# EAGLE schematic Mk3 v3.1415926535 (EAGLE 7.5.0)
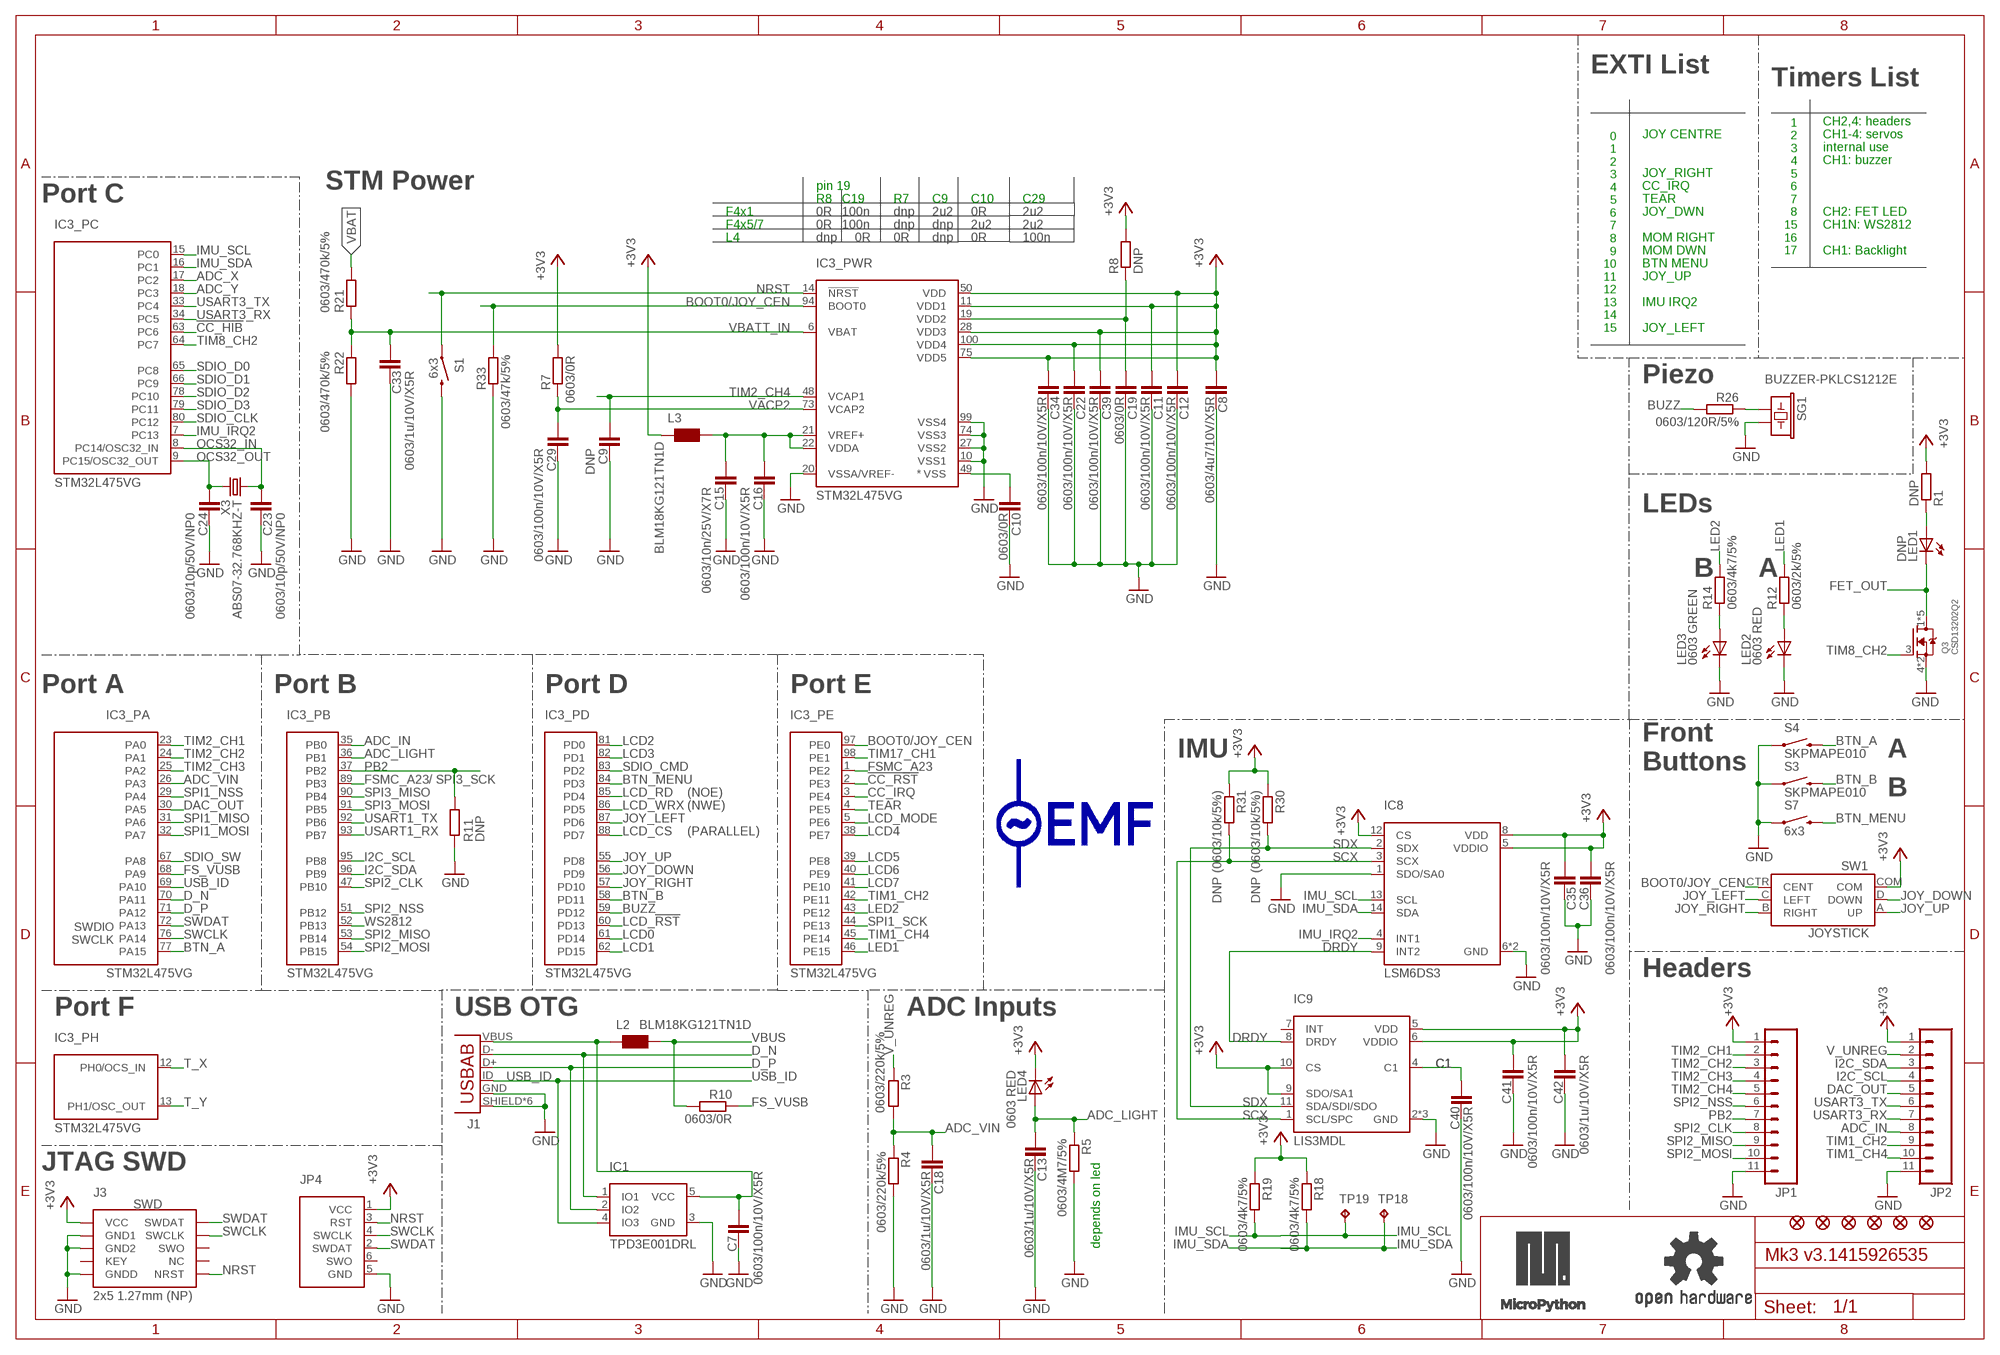
[diagram p0: schematic, sheet 1, part 1 of 2]
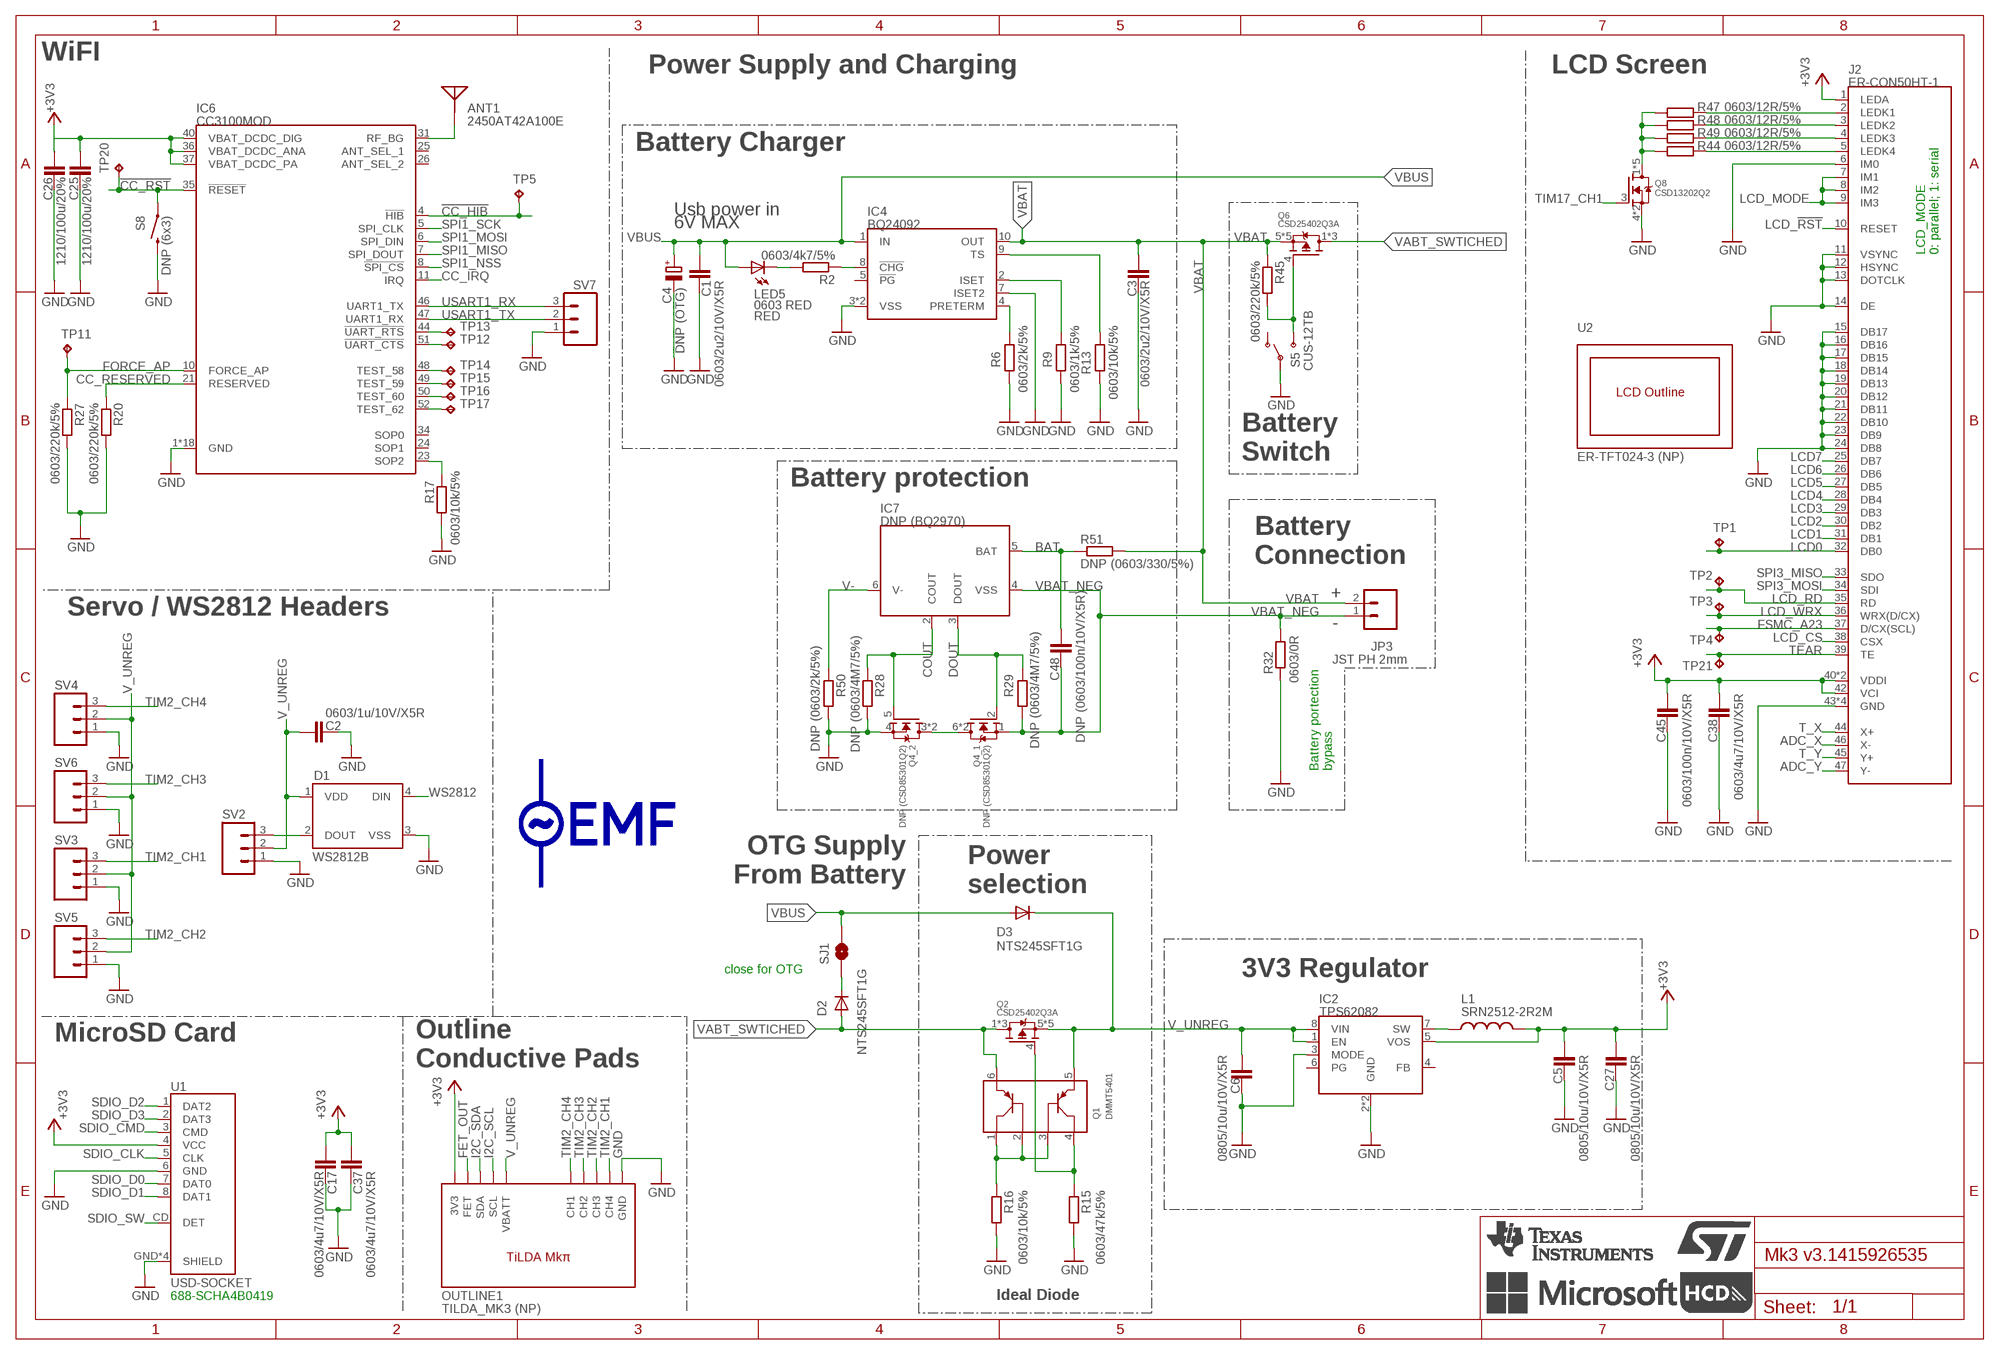
[diagram p1: schematic, sheet 1, part 2 of 2]

## Parts
ANT1  2450AT42A100E  CHIPANT  [2450AT42A100]
C1  0603/2u2/10V/X5R  C-EUC0603K-SMALL  [C0603K-SMALL]
C2  0603/1u/10V/X5R  C-EUC0603K-SMALL  [C0603K-SMALL]
C3  0603/2u2/10V/X5R  C-EUC0603K-SMALL  [C0603K-SMALL]
C4  DNP (OTG)  CPOL-EUE2.5-6  [E2,5-6]
C5  0805/10u/10V/X5R  C-EUC0805-N  [C0805-N]
C6  0805/10u/10V/X5R  C-EUC0805-N  [C0805-N]
C7  0603/100n/10V/X5R  C-EUC0603K-SMALL  [C0603K-SMALL]
C8  0603/4u7/10V/X5R  C-EUC0603K-SMALL  [C0603K-SMALL]
C9  DNP  C-EUC0603K-SMALL  [C0603K-SMALL]
C10  0603/0R  C-EUC0603K-SMALL  [C0603K-SMALL]
C11  0603/100n/10V/X5R  C-EUC0603K-SMALL  [C0603K-SMALL]
C12  0603/100n/10V/X5R  C-EUC0603K-SMALL  [C0603K-SMALL]
C13  0603/1u/10V/X5R  C-EUC0603K-SMALL  [C0603K-SMALL]
C15  0603/10n/25V/X7R  C-EUC0603K-SMALL  [C0603K-SMALL]
C16  0603/100n/10V/X5R  C-EUC0603K-SMALL  [C0603K-SMALL]
C17  0603/4u7/10V/X5R  C-EUC0603K-SMALL  [C0603K-SMALL]
C18  0603/1u/10V/X5R  C-EUC0603K-SMALL  [C0603K-SMALL]
C19  0603/0R  C-EUC0603K-SMALL  [C0603K-SMALL]
C22  0603/100n/10V/X5R  C-EUC0603K-SMALL  [C0603K-SMALL]
C23  0603/10p/50V/NP0  C-EUC0603K-SMALL  [C0603K-SMALL]
C24  0603/10p/50V/NP0  C-EUC0603K-SMALL  [C0603K-SMALL]
C25  1210/100u/20%  C-EUC1210K  [C1210K]
C26  1210/100u/20%  C-EUC1210K  [C1210K]
C27  0805/10u/10V/X5R  C-EUC0805-N  [C0805-N]
C29  0603/100n/10V/X5R  C-EUC0603K-SMALL  [C0603K-SMALL]
C33  0603/1u/10V/X5R  C-EUC0603K-SMALL  [C0603K-SMALL]
C34  0603/100n/10V/X5R  C-EUC0603K-SMALL  [C0603K-SMALL]
C35  0603/100n/10V/X5R  C-EUC0603K-SMALL  [C0603K-SMALL]
C36  0603/100n/10V/X5R  C-EUC0603K-SMALL  [C0603K-SMALL]
C37  0603/4u7/10V/X5R  C-EUC0603K-SMALL  [C0603K-SMALL]
C38  0603/4u7/10V/X5R  C-EUC0603K-SMALL  [C0603K-SMALL]
C39  0603/100n/10V/X5R  C-EUC0603K-SMALL  [C0603K-SMALL]
C40  0603/100n/10V/X5R  C-EUC0603K-SMALL  [C0603K-SMALL]
C41  0603/100n/10V/X5R  C-EUC0603K-SMALL  [C0603K-SMALL]
C42  0603/1u/10V/X5R  C-EUC0603K-SMALL  [C0603K-SMALL]
C45  0603/100n/10V/X5R  C-EUC0603K-SMALL  [C0603K-SMALL]
C48  DNP (0603/100n/10V/X5R)  C-EUC0603K-SMALL  [C0603K-SMALL]
D1  WS2812B  [WS2812B]
D2  NTS245SFT1G  1N4148-SOD123  [SOD123]
D3  NTS245SFT1G  1N4148-SOD123  [SOD123]
FID1  FIDUCIAL1X2.5-STOP  [FIDUCIAL-1X2.5-STOP]
FID2  FIDUCIAL1X2.5-STOP  [FIDUCIAL-1X2.5-STOP]
FID3  FIDUCIAL1X2.5-STOP  [FIDUCIAL-1X2.5-STOP]
FID4  FIDUCIAL1X2.5-STOP  [FIDUCIAL-1X2.5-STOP]
FID5  FIDUCIAL1X2.5-STOP  [FIDUCIAL-1X2.5-STOP]
FID6  FIDUCIAL1X2.5-STOP  [FIDUCIAL-1X2.5-STOP]
IC1  TPD3E001DRL  [DRL-5]
IC2  TPS62082  [WSON8]
IC3  STM32L475VG  STM32F401V  [TQFP100]
IC4  BQ24092  BQ2409X  [HVSSOP10]
IC6  CC3100MOD  CC3100MOD-LWK  [CC3100MOD-LWK]
IC7  DNP (BQ2970)  BQ2970  [WSON-6]
IC8  LSM6DS3  [LGA14]
IC9  LIS3MDL  [LGA12]
J1  ZX62-AB-5PA(11)  USB-AB-LWK  [USB-AB-MICRO-SMD_LWK]
J2  ER-CON50HT-1  ER-TFT024-3  [FH12-50S-0.5SH]
J3  2x5 1.27mm (NP)  SWD_SHROUD-PINHEAD  [PINHEAD_2X05_127]
JP1  (NP)  M11PTH  [1X11]
JP2  (NP)  M11PTH  [1X11]
JP3  JST PH 2mm  M02-JST-2MM-SMT  [JST-2-SMD]
JP4  (NP)  TC2030-SWDNL  [TC2030-MCP-NL]
L1  SRN2512-2R2M  INDUCTOR1008  [1008]
L2  BLM18KG121TN1D  WE-CBF_0805  [WUERTH-0805]
L3  BLM18KG121TN1D  WE-CBF_0805  [WUERTH-0805]
LED1  DNP  LED5MM  [LED5MM]
LED2  0603 RED  LED0603-CORRECT  [LED-0603-CORRECT]
LED3  0603 GREEN  LED0603-CORRECT  [LED-0603-CORRECT]
LED4  0603 RED  LED0603-CORRECT  [LED-0603-CORRECT]
LED5  0603 RED  LED0603-CORRECT  [LED-0603-CORRECT]
LOGO1  OSHW-LOGOM (NP)  OSHW-LOGOM  [OSHW-LOGO-M]
LOGO2  LOGO_TI-4MM (NP)  LOGO_TI-4MM  [LOGO_TI_4MM]
LOGO3  LOGO_ST-4MM (NP)  LOGO_ST-4MM  [LOGO_ST_4MM]
LOGO4  LOGO_HCD-4MM (NP)  LOGO_HCD-4MM  [LOGO_HDC_4MM]
LOGO5  LOGO_MICROSOFT-4MM (NP)  LOGO_MICROSOFT-4MM  [LOGO_MS_4MM]
LOGO6  LOGO_MICROPYTHON-8MM (NP)  LOGO_MICROPYTHON-8MM  [LOGO_MICROPYTHON_8MM]
OUTLINE1  TILDA_MK3 (NP)  TILDA_MK3_BOARDOUTLINE  [TILDA_MKE_OUTLINE]
Q1  DMMT5401  [SOT26]
Q2  CSD25402Q3A  [Q3A]
Q3  CSD13202Q2  [Q2]
Q4  DNP (CSD85301Q2)  CSD85301Q2  [Q2_DUAL]
Q6  CSD25402Q3A  [Q3A]
Q8  CSD13202Q2  [Q2]
R1  DNP  R-EU_0207/10  [0207/10]
R2  0603/4k7/5%  R-EU_0603K-SMALL  [C0603K-SMALL]
R3  0603/220k/5%  R-EU_0603K-SMALL  [C0603K-SMALL]
R4  0603/220k/5%  R-EU_0603K-SMALL  [C0603K-SMALL]
R5  0603/4M7/5%  R-EU_0603K-SMALL  [C0603K-SMALL]
R6  0603/2k/5%  R-EU_0603K-SMALL  [C0603K-SMALL]
R7  0603/0R  R-EU_0603K-SMALL  [C0603K-SMALL]
R8  DNP  R-EU_0603K-SMALL  [C0603K-SMALL]
R9  0603/1k/5%  R-EU_0603K-SMALL  [C0603K-SMALL]
R10  0603/0R  R-EU_0603K-SMALL  [C0603K-SMALL]
R11  DNP  R-EU_0603K-SMALL  [C0603K-SMALL]
R12  0603/2k/5%  R-EU_0603K-SMALL  [C0603K-SMALL]
R13  0603/10k/5%  R-EU_0603K-SMALL  [C0603K-SMALL]
R14  0603/4k7/5%  R-EU_0603K-SMALL  [C0603K-SMALL]
R15  0603/47k/5%  R-EU_0603K-SMALL  [C0603K-SMALL]
R16  0603/10k/5%  R-EU_0603K-SMALL  [C0603K-SMALL]
R17  0603/10k/5%  R-EU_0603K-SMALL  [C0603K-SMALL]
R18  0603/4k7/5%  R-EU_0603K-SMALL  [C0603K-SMALL]
R19  0603/4k7/5%  R-EU_0603K-SMALL  [C0603K-SMALL]
R20  0603/220k/5%  R-EU_0603K-SMALL  [C0603K-SMALL]
R21  0603/470k/5%  R-EU_0603K-SMALL  [C0603K-SMALL]
R22  0603/470k/5%  R-EU_0603K-SMALL  [C0603K-SMALL]
R26  0603/120R/5%  R-EU_0603K-SMALL  [C0603K-SMALL]
R27  0603/220k/5%  R-EU_0603K-SMALL  [C0603K-SMALL]
R28  DNP (0603/4M7/5%)  R-EU_0603K-SMALL  [C0603K-SMALL]
R29  DNP (0603/4M7/5%)  R-EU_0603K-SMALL  [C0603K-SMALL]
R30  DNP (0603/10k/5%)  R-EU_0603K-SMALL  [C0603K-SMALL]
R31  DNP (0603/10k/5%)  R-EU_0603K-SMALL  [C0603K-SMALL]
R32  0603/0R  R-EU_0603K-SMALL  [C0603K-SMALL]
R33  0603/47k/5%  R-EU_0603K-SMALL  [C0603K-SMALL]
R44  0603/12R/5%  R-EU_0603K-SMALL  [C0603K-SMALL]
R45  0603/220k/5%  R-EU_0603K-SMALL  [C0603K-SMALL]
R47  0603/12R/5%  R-EU_0603K-SMALL  [C0603K-SMALL]
R48  0603/12R/5%  R-EU_0603K-SMALL  [C0603K-SMALL]
R49  0603/12R/5%  R-EU_0603K-SMALL  [C0603K-SMALL]
R50  DNP (0603/2k/5%)  R-EU_0603K-SMALL  [C0603K-SMALL]
R51  DNP (0603/330/5%)  R-EU_0603K-SMALL  [C0603K-SMALL]
S1  6x3  SWITCH-MOMENTARY-2-SMD-1101NE  [TACTILE-SWITCH-1101NE]
S3  SKPMAPE010  SWITCH-MOMENTARY-2-SKPMAPE010-COMBINED  [SKPMAPE010-COMBINED]
S4  SKPMAPE010  SWITCH-MOMENTARY-2-SKPMAPE010-COMBINED  [SKPMAPE010-COMBINED]
S5  CUS-12TB  SWITCH-SPST-SMD-A  [SWITCH-SPST-SMD-A]
S7  6x3  SWITCH-MOMENTARY-2-SMD-1101NE  [TACTILE-SWITCH-1101NE]
S8  DNP (6x3)  SWITCH-MOMENTARY-2-SMD-1101NE  [TACTILE-SWITCH-1101NE]
SG1  BUZZER-PKLCS1212E  [BUZZER-PKLCS1212E]
SJ1  OTG (NP)  SOLDERJUMPERNO  [SJ_2S-NO]
SV2  (NP)  M03PTH  [1X03]
SV3  (NP)  M03PTH  [1X03]
SV4  (NP)  M03PTH  [1X03]
SV5  (NP)  M03PTH  [1X03]
SV6  (NP)  M03PTH  [1X03]
SV7  (NP)  M03PTH  [1X03]
SW1  JOYSTICK  JOYSTICK_MINI_MULTICOM_NOSILK  [JOYSTICK_MULTICOMP_NOSILK]
TP1  (NP)  TPB1,27  [B1,27]
TP2  (NP)  TPB1,27  [B1,27]
TP3  (NP)  TPB1,27  [B1,27]
TP4  (NP)  TPB1,27  [B1,27]
TP5  (NP)  TPB1,27  [B1,27]
TP11  (NP)  TPB1,27  [B1,27]
TP12  (NP)  TPB1,27  [B1,27]
TP13  (NP)  TPB1,27  [B1,27]
TP14  (NP)  TPB1,27  [B1,27]
TP15  (NP)  TPB1,27  [B1,27]
TP16  (NP)  TPB1,27  [B1,27]
TP17  (NP)  TPB1,27  [B1,27]
TP18  (NP)  TPB1,27  [B1,27]
TP19  (NP)  TPB1,27  [B1,27]
TP20  (NP)  TPB1,27  [B1,27]
TP21  (NP)  TPB1,27  [B1,27]
U1  USD-SOCKET  USD-SOCKET-SDIO  [0011XAAX09X]
U2  ER-TFT024-3 (NP)  ER-TFT024-3-OUTLINE  [ER-TFT024-3]
X3  ABS07-32.768KHZ-T  RESONATOR_EPSON_FC_145  [RESONATOR_EPSON_FC_145]

## Nets
!CC_HIB: IC3.63(_PC:PC6) IC6.4(!HIB) TP5.TP
!CC_RST: IC3.2(_PE:PE3) IC6.35(!RESET) S8.P$1 TP20.TP
!UART_CTS: IC6.51(!UART_CTS) TP12.TP
!UART_RTS: IC6.44(!UART_RTS) TP13.TP
+3V3: C5.1 C8.2 C11.2 C12.2 C17.2 C22.2 C25.1 C26.1 C27.1 C34.2 C35.1 C36.1 C37.2 C38.2 C39.2 C41.1 C42.1 C45.2 IC2.5(VOS) IC3.11(_PWR:VDD1) IC3.28(_PWR:VDD3) IC3.50(_PWR:VDD) IC3.75(_PWR:VDD5) IC3.100(_PWR:VDD4) IC6.36(VBAT_DCDC_ANA) IC6.37(VBAT_DCDC_PA) IC6.40(VBAT_DCDC_DIG) IC8.5(VDDIO) IC8.8(VDD) IC8.12(CS) IC9.5(VDD) IC9.6(VDDIO) IC9.9(SDO/SA1) IC9.10(CS) J2.1(LEDA) J2.40(VDDI) J2.41(VDDI) J2.42(VCI) J3.1(VCC) JP1.1 JP2.1 JP4.1(VCC) L1.2 L3.1 LED4.C OUTLINE1.3V3 R1.2 R7.1 R8.2 R18.1 R19.1 R30.1 R31.1 SW1.COM U1.4(VCC)
ADC_IN: IC3.35(_PB:PB0) JP2.8
ADC_LIGHT: C13.2 IC3.36(_PB:PB1) LED4.A R5.1
ADC_VIN: C18.2 IC3.26(_PA:PA3) R3.2 R4.1
ADC_X: IC3.17(_PC:PC2) J2.46(X-)
ADC_Y: IC3.18(_PC:PC3) J2.47(Y-)
BAT: C48.2 IC7.5(BAT) R51.1
BOOT0/JOY_CEN: IC3.94(_PWR:BOOT0) IC3.97(_PE:PE0) R33.2 SW1.CTR(CENT)
BTN_A: IC3.77(_PA:PA15) S4.2 S4.B1 S4.B2
BTN_B: IC3.58(_PD:PD11) S3.2 S3.B1 S3.B2
BTN_MENU: IC3.84(_PD:PD3) S7.P$2
BUZZ: IC3.59(_PD:PD12) R26.2
C1: C40.1 IC9.4(C1)
CC_IRQ: IC3.3(_PE:PE4) IC6.11(IRQ)
CC_RESERVED: IC6.21(RESERVED) R20.1
COUT: IC7.2(COUT) Q4.5(_2:G) R28.1
D_N: IC1.1(IO1) IC3.70(_PA:PA11) J1.D-
D_P: IC1.2(IO2) IC3.71(_PA:PA12) J1.D+
DAC_OUT: IC3.30(_PA:PA5) JP2.5
DFGFDG: C15.2 C16.2 IC3.21(_PWR:VREF+) IC3.22(_PWR:VDDA) L3.2
DOUT: IC7.3(DOUT) Q4.2(_1:G) R29.1
DRDY: IC8.9(INT2) IC9.8(DRDY)
FET_OUT: LED1.K(C) OUTLINE1.FET Q3.1(D) Q3.2(D) Q3.5(D) Q3.6(D) Q3.EP1(D)
FORCE_AP: IC6.10(FORCE_AP) R27.1 TP11.TP
FS_VUSB: IC3.68(_PA:PA9) R10.1
FSMC_A23: IC3.1(_PE:PE2) IC3.89(_PB:PB3) J2.37(D/CX(SCL)) TP4.TP
GND: C1.1 C2.1 C3.1 C4.- C5.2 C6.2 C7.1 C8.1 C9.1 C10.1 C11.1 C12.1 C13.1 C15.1 C16.1 C17.1 C18.1 C19.1 C22.1 C23.1 C24.1 C25.2 C26.2 C27.2 C29.1 C33.1 C34.1 C35.2 C36.2 C37.1 C38.1 C39.1 C40.2 C41.2 C42.2 C45.1 D1.3(VSS) IC1.3(GND) IC2.2(GND) IC2.3(MODE) IC2.EP(GND) IC3.10(_PWR:VSS1) IC3.20(_PWR:VSSA/VREF-) IC3.27(_PWR:VSS2) IC3.74(_PWR:VSS3) IC3.99(_PWR:VSS4) IC4.3(VSS) IC4.7(ISET2) IC4.EP(VSS) IC6.1(GND) IC6.2(GND) IC6.16(GND) IC6.27(GND) IC6.28(GND) IC6.30(GND) IC6.32(GND) IC6.38(GND) IC6.43(GND) IC6.55(GND) IC6.56(GND) IC6.57(GND) IC6.58(GND) IC6.59(GND) IC6.60(GND) IC6.61(GND) IC6.62(GND) IC6.63(GND) IC8.1(SDO/SA0) IC8.6(GND) IC8.7(GND) IC9.2(GND) IC9.3(GND) IC9.12(GND) J1.GND J1.SHIELD J1.SHIELD@0(SHIELD) J1.SHIELD@1(SHIELD) J1.SHIELD@2(SHIELD) J1.SHIELD@3(SHIELD) J1.SHIELD@5(SHIELD) J2.6(IM0) J2.11(VSYNC) J2.12(HSYNC) J2.13(DOTCLK) J2.14(DE) J2.15(DB17) J2.16(DB16) J2.17(DB15) J2.18(DB14) J2.19(DB13) J2.20(DB12) J2.21(DB11) J2.22(DB10) J2.23(DB9) J2.24(DB8) J2.43(GND) J2.48(GND) J2.49(GND) J2.50(GND) J3.3(GND1) J3.5(GND2) J3.9(GNDD) JP1.11 JP2.11 JP4.5(GND) LED2.C LED3.C OUTLINE1.GND Q3.4(S) Q3.EP2(S) Q4.4(_2:S) Q8.4(S) Q8.EP2(S) R4.2 R5.2 R6.2 R9.2 R11.1 R13.2 R15.2 R16.2 R17.2 R20.2 R22.2 R27.2 R28.2 R32.1 R33.1 R50.2 S1.P$2 S3.1 S3.A1 S3.A2 S4.1 S4.A1 S4.A2 S5.2(P) S7.P$1 S8.P$2 SG1.P$2 SV2.1 SV3.1 SV4.1 SV5.1 SV6.1 SV7.1 U1.6(GND) U1.GND1(SHIELD) U1.GND2(SHIELD) U1.GND3(SHIELD) U1.GND(SHIELD)
I2C_SCL: IC3.95(_PB:PB8) JP2.4 OUTLINE1.SCL
I2C_SDA: IC3.96(_PB:PB9) JP2.3 OUTLINE1.SDA
IMU_IRQ2: IC3.7(_PC:PC13) IC8.4(INT1)
IMU_SCL: IC3.15(_PC:PC0) IC8.13(SCL) R19.2 TP19.TP
IMU_SDA: IC3.16(_PC:PC1) IC8.14(SDA) R18.2 TP18.TP
JOY_DOWN: IC3.56(_PD:PD9) SW1.D(DOWN)
JOY_LEFT: IC3.87(_PD:PD6) SW1.C(LEFT)
JOY_RIGHT: IC3.57(_PD:PD10) SW1.B(RIGHT)
JOY_UP: IC3.55(_PD:PD8) SW1.A(UP)
LCD0: IC3.61(_PD:PD14) J2.32(DB0) TP1.TP
LCD1: IC3.62(_PD:PD15) J2.31(DB1)
LCD2: IC3.81(_PD:PD0) J2.30(DB2)
LCD3: IC3.82(_PD:PD1) J2.29(DB3)
LCD4: IC3.38(_PE:PE7) J2.28(DB4)
LCD5: IC3.39(_PE:PE8) J2.27(DB5)
LCD6: IC3.40(_PE:PE9) J2.26(DB6)
LCD7: IC3.41(_PE:PE10) J2.25(DB7)
LCD_!RST: IC3.60(_PD:PD13) J2.10(RESET)
LCD_CS: IC3.88(_PD:PD7) J2.38(CSX)
LCD_MODE: IC3.5(_PE:PE6) J2.7(IM1) J2.8(IM2) J2.9(IM3)
LCD_RD: IC3.85(_PD:PD4) J2.35(RD) TP2.TP
LCD_WRX: IC3.86(_PD:PD5) J2.36(WRX(D/CX)) TP3.TP
LED1: IC3.46(_PE:PE15) R12.2
LED2: IC3.43(_PE:PE12) R14.2
LEDK1: J2.2(LEDK1) R47.2
LEDK2: J2.3(LEDK2) R48.2
LEDK3: J2.4(LEDK3) R49.2
LEDK4: J2.5(LEDK4) R44.2
N$3: Q4.3(_2:D) Q4.6(_1:D) Q4.EP1(_1:D) Q4.EP2(_2:D)
N$4: R26.1 SG1.P$1
N$5: C19.2 IC3.19(_PWR:VDD2) R8.1
N$6: Q1.4(C2) Q2.4(G) R15.1
N$7: Q1.1(C1) Q1.2(B1) Q1.3(B2) R16.1
N$8: LED5.C R2.2
N$9: IC4.8(!CHG) R2.1
N$10: IC4.4(PRETERM) R6.1
N$11: IC4.2(ISET) R9.1
N$12: IC4.9(TS) R13.1
N$21: D1.2(DOUT) SV2.3
N$27: C7.2 IC1.5(VCC) J1.VBUS L2.1
N$28: D2.C SJ1.1
N$36: ANT1.P$1 IC6.31(RF_BG)
N$37: C10.2 IC3.49(_PWR:VSS)
N$51: LED3.A R14.1
N$52: LED2.A R12.1
N$60: LED1.A R1.1
N$64: Q8.1(D) Q8.2(D) Q8.5(D) Q8.6(D) Q8.EP1(D) R44.1 R47.1 R48.1 R49.1
NRST: IC3.14(_PWR:!NRST) J3.10(NRST) JP4.3(RST) S1.P$1
OCS32_IN: C23.2 IC3.8(_PC:PC14/OSC32_IN) X3.P$1
OCS32_OUT: C24.2 IC3.9(_PC:PC15/OSC32_OUT) X3.P$2
PB2: IC3.37(_PB:PB2) JP1.7 R11.2
SCX: IC8.3(SCX) IC9.1(SCL/SPC) R31.2
SDIO_CLK: IC3.80(_PC:PC12) U1.5(CLK)
SDIO_CMD: IC3.83(_PD:PD2) U1.3(CMD)
SDIO_D0: IC3.65(_PC:PC8) U1.7(DAT0)
SDIO_D1: IC3.66(_PC:PC9) U1.8(DAT1)
SDIO_D2: IC3.78(_PC:PC10) U1.1(DAT2)
SDIO_D3: IC3.79(_PC:PC11) U1.2(DAT3)
SDIO_SW: IC3.67(_PA:PA8) U1.CD(DET)
SDX: IC8.2(SDX) IC9.11(SDA/SDI/SDO) R30.2
SOP2: IC6.23(SOP2) R17.1
SPI1_MISO: IC3.31(_PA:PA6) IC6.7(SPI_DOUT)
SPI1_MOSI: IC3.32(_PA:PA7) IC6.6(SPI_DIN)
SPI1_NSS: IC3.29(_PA:PA4) IC6.8(!SPI_CS)
SPI1_SCK: IC3.44(_PE:PE13) IC6.5(SPI_CLK)
SPI2_CLK: IC3.47(_PB:PB10) JP1.8
SPI2_MISO: IC3.53(_PB:PB14) JP1.9
SPI2_MOSI: IC3.54(_PB:PB15) JP1.10
SPI2_NSS: IC3.51(_PB:PB12) JP1.6
SPI3_MISO: IC3.90(_PB:PB4) J2.33(SDO)
SPI3_MOSI: IC3.91(_PB:PB5) J2.34(SDI)
SW: IC2.7(SW) L1.1
SWCLK: IC3.76(_PA:PA14) J3.4(SWCLK) JP4.4(SWCLK)
SWDAT: IC3.72(_PA:PA13) J3.2(SWDAT) JP4.2(SWDAT)
T_X: IC3.12(_PH:PH0/OCS_IN) J2.44(X+)
T_Y: IC3.13(_PH:PH1/OSC_OUT) J2.45(Y+)
TEAR: IC3.4(_PE:PE5) J2.39(TE) TP21.TP
TEST_58: IC6.48(TEST_58) TP14.TP
TEST_59: IC6.49(TEST_59) TP15.TP
TEST_60: IC6.50(TEST_60) TP16.TP
TEST_62: IC6.52(TEST_62) TP17.TP
TIM1_CH2: IC3.42(_PE:PE11) JP2.9
TIM1_CH4: IC3.45(_PE:PE14) JP2.10
TIM2_CH1: IC3.23(_PA:PA0) JP1.2 OUTLINE1.CH4 SV3.3
TIM2_CH2: IC3.24(_PA:PA1) JP1.3 OUTLINE1.CH3 SV5.3
TIM2_CH3: IC3.25(_PA:PA2) JP1.4 OUTLINE1.CH2 SV6.3
TIM2_CH4: C9.2 IC3.48(_PWR:VCAP1) JP1.5 OUTLINE1.CH1 SV4.3
TIM8_CH2: IC3.64(_PC:PC7) Q3.3(G)
TIM17_CH1: IC3.98(_PE:PE1) Q8.3(G)
USART1_RX: IC3.93(_PB:PB7) IC6.46(UART1_TX) SV7.3
USART1_TX: IC3.92(_PB:PB6) IC6.47(UART1_RX) SV7.2
USART3_RX: IC3.34(_PC:PC5) JP2.7
USART3_TX: IC3.33(_PC:PC4) JP2.6
USB_ID: IC1.4(IO3) IC3.69(_PA:PA10) J1.ID(USBID)
V-: IC7.6(V-) R50.1
V_UNREG: C2.2 C6.1 D1.1(VDD) D3.C IC2.1(EN) IC2.8(VIN) JP2.2 OUTLINE1.VBATT Q1.5(E2) Q2.5(S) Q2.6(S) Q2.7(S) Q2.8(S) Q2.EP(S) R3.1 SV2.2 SV3.2 SV4.2 SV5.2 SV6.2
VABT_SWTICHED: D2.A Q1.6(E1) Q2.1(D) Q2.2(D) Q2.3(D) Q6.1(D) Q6.2(D) Q6.3(D)
VACP2: C29.2 IC3.73(_PWR:VCAP2) R7.2
VBAT: C3.2 IC4.10(OUT) JP3.2 Q6.5(S) Q6.6(S) Q6.7(S) Q6.8(S) Q6.EP(S) R21.2 R45.1 R51.2
VBAT_NEG: C48.1 IC7.4(VSS) JP3.1 Q4.1(_1:S) R29.2 R32.2
VBAT_SWITCH_CONTROL: Q6.4(G) R45.2 S5.3(S)
VBATT_IN: C33.2 IC3.6(_PWR:VBAT) R21.1 R22.1
VBUS: C1.2 C4.+ D3.A IC4.1(IN) L2.2 LED5.A R10.2 SJ1.2
WS2812: D1.4(DIN) IC3.52(_PB:PB13)
Unconnected: IC2.4(FB) IC2.6(PG) IC4.5(!PG) IC6.24(SOP1) IC6.25(ANT_SEL_1) IC6.26(ANT_SEL_2) IC6.34(SOP0) IC9.7(INT) J3.6(SWO) J3.7(KEY) J3.8(NC) JP4.6(SWO) S5.1(O)

## Notes on the sheet
- WiFI
- EXTI List | Power Supply and Charging | LCD Screen
- Timers List
- CH2,4: headers
- JOY CENTRE | CH1-4: servos
- internal use | Battery Charger
- CH1: buzzer
- JOY_RIGHT
- STM Power | pin 19 | CC_IRQ
- Port C | R8 | C19 | R7 | C9 | C10 | C29 | TEAR
- F4x1 | 0R | 100n | dnp | 2u2 | 0R | 2u2 | JOY_DWN | CH2: FET LED | Usb power in
- F4x5/7 | 0R | 100n | dnp | dnp | 2u2 | 2u2 | CH1N: WS2812 | 6V MAX
- L4 | dnp | 0R | 0R | dnp | 0R | 100n | MOM RIGHT
- MOM DWN
- 1
  2
  3
  4
  5
  6
  7
  8
  15
  16
  17
- CH1: Backlight
- LCD_MODE
  0: parallel; 1: serial
- BTN MENU
- JOY_UP
- IMU IRQ2
- 0
  1
  2
  3
  4
  5
  6
  7
  8
  9
  10
  11
  12
  13
  14
  15
- JOY_LEFT
- Piezo
- Battery 
  Switch
- Battery protection
- LEDs
- Battery
  Connection
- B | A
- +
- Servo / WS2812 Headers
- -
- Port A | Port B | Port D | Port E
- IMU | A
- Front 
  Buttons
- Battery portection
  bypass
- / SPI3_SCK
- (NOE) | B
- (NWE)
- (PARALLEL)
- OTG Supply
  From Battery
- Power
  selection
- close for OTG
- Headers | 3V3 Regulator
- Port F | USB OTG | ADC Inputs
- MicroSD Card
- Outline
  Conductive Pads
- JTAG SWD
- depends on led
- 688-SCHA4B0419 | Ideal Diode

## Library data of the parts
ANT1 = TiLDA Mk3 Parts:CHIPANT; FARNELL: 2148522
C1-C3 C5-C13 C15-C19 C22-C24 C27 C29 C33-C42 C45 C48 = TiLDA Mk3 Parts:C-EU: CAPACITOR, European symbol
C4 = TiLDA Mk3 Parts:CPOL-EU: POLARIZED CAPACITOR, European symbol
C25 C26 = TiLDA Mk3 Parts:C-EU: CAPACITOR, European symbol; FARNELL: 1828817
D1 = TiLDA Mk3 Parts:WS2812B: WS2812B - Intelligent control LED integrated light source Technical Specifications: Power Supply Voltage (VDD): 3.5 to 5.3 V Input Voltage (VI): -0.5 to VDD+0.5 V Operating Junction Temperature (Topt): -25°C to +80°C Storage Temperature Range (Tstg): -55°C to +150°C; EBAY: 291036714575
D2 D3 = TiLDA Mk3 Parts:1N4148
FID1-FID6 = TiLDA Mk3 Parts:FIDUCIAL: Fiducial Alignment Points Various fiducial points for machine vision alignment.
IC1 = TiLDA Mk3 Parts:TPD3E001; FARNELL: 1603422
IC2 = TiLDA Mk3 Parts:TPS62082; FARNELL: 2064227
IC3 = TiLDA Mk3 Parts:STM32F401V; FARNELL: 2432116
IC4 = TiLDA Mk3 Parts:BQ2409X; FARNELL: 2323723
IC6 = TiLDA Mk3 Parts:CC3100MOD; MOUSER: 595-3100MODR11MAMOBR
IC7 = TiLDA Mk3 Parts:BQ2970; FARNELL: 2425793
IC8 = TiLDA Mk3 Parts:LSM6DS3; FARNELL: 2474253
IC9 = TiLDA Mk3 Parts:LIS3MDL; FARNELL: 2433083
J1 = TiLDA Mk3 Parts:USB-AB: This is a USB AB connector that is compatible with USB OTG. i.e. this connector can serve as a host or device; FARNELL: 2293755
J2 = TiLDA Mk3 Parts:ER-TFT024-3
J3 = TiLDA Mk3 Parts:SWD_SHROUD; FARNELL: 1865285
JP1 JP2 = TiLDA Mk3 Parts:M11: Header 11 Standard 11-pin 0.1" header. Use with straight break away headers (SKU : PRT-00116), right angle break away headers (PRT-00553), swiss pins (PRT-00743), machine pins (PRT-00117), and female headers (PRT-00115).
JP3 = TiLDA Mk3 Parts:M02: Header 2 Standard 2-pin 0.1" header. Use with straight break away headers (SKU : PRT-00116), right angle break away headers (PRT-00553), swiss pins (PRT-00743), machine pins (PRT-00117), and female headers (PRT-00115). Molex polarized connector foot print use with SKU : PRT-08233 with associated crimp pins and housings.; FARNELL: 9492615
JP4 = TiLDA Mk3 Parts:TC2030-SWD
L1 = TiLDA Mk3 Parts:INDUCTOR: Inductors Basic Inductor/Choke - 0603 and 1206. Footprints are not proven and vary greatly between part numbers.; FARNELL: 2428203
L2 L3 = TiLDA Mk3 Parts:WE-CBF: SMD EMI Suppression Ferrite Beads - excellent anti-EMI properties - low DCR - impedances till 3000 ohms - rated current up to 6 A; FARNELL: 1781089
LED1 = TiLDA Mk3 Parts:LED: LEDs Standard schematic elements and footprints for 5mm, 3mm, 1206, and 0603 sized LEDs. 5mm - Spark Fun Electronics SKU : COM-00529 (and others)
LED2 LED4 LED5 = TiLDA Mk3 Parts:LED: LEDs Standard schematic elements and footprints for 5mm, 3mm, 1206, and 0603 sized LEDs. 5mm - Spark Fun Electronics SKU : COM-00529 (and others); COLOUR: RED; FARNELL: 2449874
LED3 = TiLDA Mk3 Parts:LED: LEDs Standard schematic elements and footprints for 5mm, 3mm, 1206, and 0603 sized LEDs. 5mm - Spark Fun Electronics SKU : COM-00529 (and others); COLOUR: GREEN; FARNELL: 2426215
LOGO1 = TiLDA Mk3 Parts:OSHW-LOGO: Open Source Hardware Logo This logo indicates the piece of hardware it is found on incorporates a OSHW license and/or adheres to the definition of open source hardware found here: http://freedomdefined.org/OSHW
LOGO2 = TiLDA Mk3 Parts:LOGO_TI
LOGO3 = TiLDA Mk3 Parts:LOGO_ST
LOGO4 = TiLDA Mk3 Parts:LOGO_HCD
LOGO5 = TiLDA Mk3 Parts:LOGO_MICROSOFT
LOGO6 = TiLDA Mk3 Parts:LOGO_MICROPYTHON
OUTLINE1 = TiLDA Mk3 Parts:TILDA_MK3_BOARDOUTLINE
Q1 = TiLDA Mk3 Parts:DMMT5401; FARNELL: 1773583
Q2 Q6 = TiLDA Mk3 Parts:CSD25402Q3A; FARNELL: 2501103
Q3 Q8 = TiLDA Mk3 Parts:CSD13202Q2; FARNELL: 2501084
Q4 = TiLDA Mk3 Parts:CSD85301Q2; FARNELL: 2470183
R1-R22 R26 R27 R30-R33 R45 R50 R51 = TiLDA Mk3 Parts:R-EU_: RESISTOR, European symbol
R28 R29 = TiLDA Mk3 Parts:R-EU_: RESISTOR, European symbol; FARNELL: 2059694
R44 R47-R49 = TiLDA Mk3 Parts:R-EU_: RESISTOR, European symbol; FARNELL: 9331280; FARNELL_REEL: 2130678
S1 S7 S8 = TiLDA Mk3 Parts:SWITCH-MOMENTARY-2: Various NO switches- pushbuttons, reed, etc
S3 S4 = TiLDA Mk3 Parts:SWITCH-MOMENTARY-2: Various NO switches- pushbuttons, reed, etc; FARNELL: 1217769
S5 = TiLDA Mk3 Parts:SWITCH-SPST: SPST Switch Simple slide switch. Spark Fun Electronics SKU : COM-00102; FARNELL: 9575146
SG1 = TiLDA Mk3 Parts:BUZZER: Buzzer 12mm Spark Fun Electronics SKU : Comp-Buzzer
SJ1 = TiLDA Mk3 Parts:SOLDERJUMPER: Solder Jumper Standard SMD solder jumper. Used to automate production. Two varients : Normally Open and Normally Closed are the same, but have different paste layers. NC will have a large amount of paste and should jumper during reflow.
SV2-SV7 = TiLDA Mk3 Parts:M03: Header 3 Standard 3-pin 0.1" header. Use with straight break away headers (SKU : PRT-00116), right angle break away headers (PRT-00553), swiss pins (PRT-00743), machine pins (PRT-00117), and female headers (PRT-00115). Molex polarized connector foot print use with SKU : PRT-08232 with associated crimp pins and housings.
SW1 = TiLDA Mk3 Parts:JOYSTICK_MINI; FARNELL: 1316987
TP1-TP5 TP11-TP21 = TiLDA Mk3 Parts:TP: Test pad
U1 = TiLDA Mk3 Parts:USD-SOCKET-SDIO; FARNELL: 2427719
U2 = TiLDA Mk3 Parts:ER-TFT024-3-OUTLINE
X3 = TiLDA Mk3 Parts:RESONATOR_EPSON_FC_145; FARNELL: 2101347

## Net classes
0 default: width 0.15 mm, drill 0.3 mm
1 ANT: width 1.27 mm, drill 0.4 mm, clearance 0.4 mm
2 90R: width 0.5 mm, drill 0.3 mm, clearance 0.7 mm to class 0, clearance 0.1 mm
3 100R: width 0.15 mm, drill 0.3 mm, clearance 0.6 mm to class 2, clearance 0.4 mm
4 5V0: width 0.406 mm, drill 0.3 mm, clearance 0.6 mm to class 2, clearance 0.6 mm to class 3
5 3V3: width 0.254 mm, drill 0.3 mm, clearance 0.6 mm to class 2, clearance 0.6 mm to class 3
6 1V8: width 0.254 mm, drill 0.3 mm, clearance 0.6 mm to class 2, clearance 0.6 mm to class 3
7 H5V0: width 0.254 mm, drill 0.3 mm, clearance 0.6 mm to class 2, clearance 0.6 mm to class 3
8 MAINS: clearance 4 mm to class 0, clearance 4 mm to class 1, clearance 4 mm to class 2, clearance 4 mm to class 3, clearance 4 mm to class 4, clearance 4 mm to class 5, clearance 4 mm to class 6, clearance 4 mm to class 7, clearance 4 mm